# Altium schematic sheet VALVEBOARD_DigitalPower.SchDoc
size A4; SheetNumber: 3; SheetTotal: 9
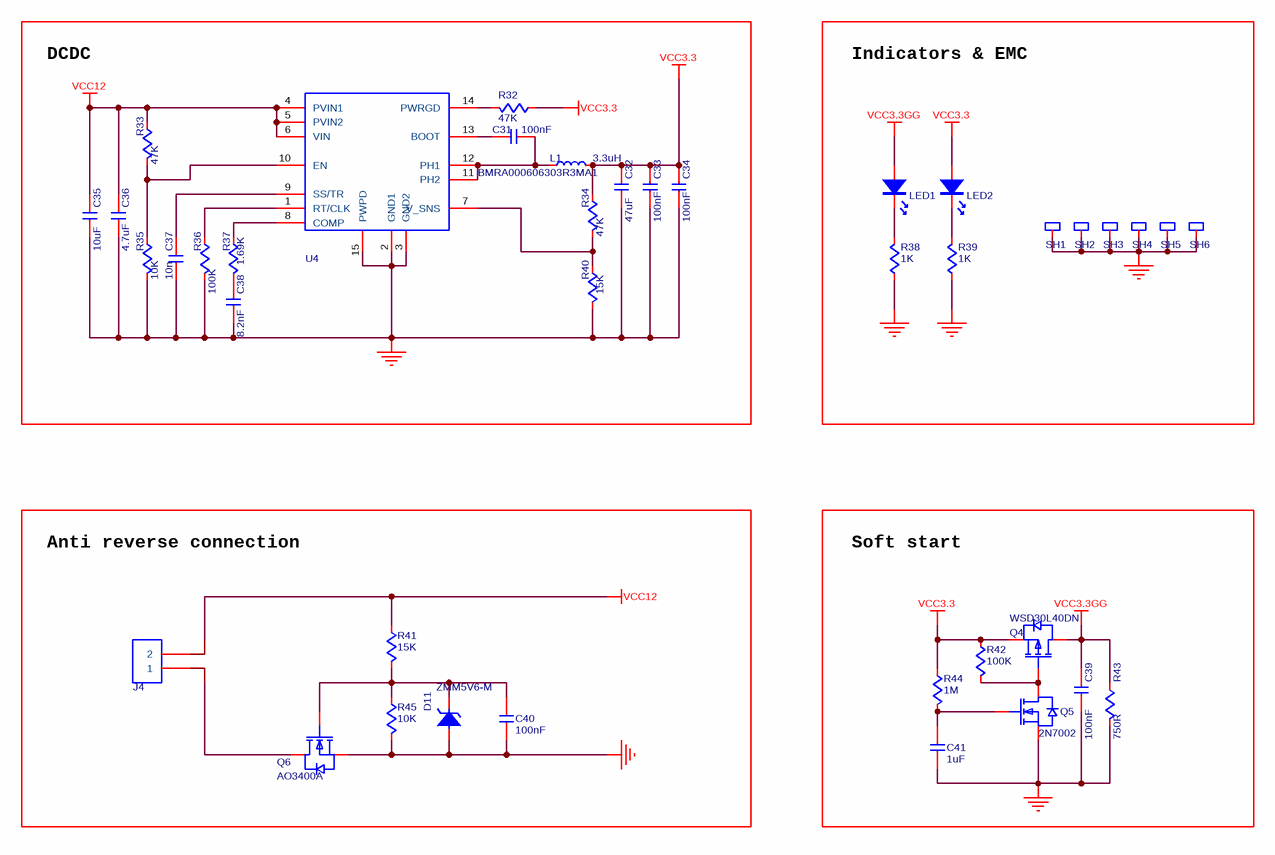
[diagram p0: VALVEBOARD_DigitalPower.SchDoc]

## Parts
C31  value 100nF  [C0402]  (hidden comment: C-NOMO)
C32  value 47uF  [C0805]  (hidden comment: C-NOMO)
C33  value 100nF  [C0402]  (hidden comment: C-NOMO)
C34  value 100nF  [C0402]  (hidden comment: C-NOMO)
C35  value 10uF  [C0805]  (hidden comment: C-NOMO)
C36  value 4.7uF  [C0805]  (hidden comment: C-NOMO)
C37  value 10n  [C0402]  (hidden comment: C-NOMO)
C38  value 8.2nF  [C0402]  (hidden comment: C-NOMO)
C39  value 100nF  [C0402]  (hidden comment: C-NOMO)
C40  value 100nF  [C0402]  (hidden comment: C-NOMO)
C41  value 1uF  [C0603]  (hidden comment: C-NOMO)
D11  ZMM5V6-M  [ZMM5V6-M]
J4  HDR1X2  [KF301-5.0-2P]  (value not drawn)
L1  BMRA000606303R3MA1  value 3.3uH  [FXL0624]
LED1  LED  [LED0603]  (value not drawn)
LED2  LED  [LED0603]  (value not drawn)
Q4  WSD30L40DN  [WSD30L40DN]
Q5  2N7002  [2N7002]
Q6  AO3400A  [AO3400A]
R32  value 47K  [R0402]  (hidden comment: R)
R33  value 47K  [R0402]  (hidden comment: R)
R34  value 47K  [R0402]  (hidden comment: R)
R35  value 10K  [R0402]  (hidden comment: R)
R36  value 100K  [R0402]  (hidden comment: R)
R37  value 1.69K  [R0402]  (hidden comment: R)
R38  value 1K  [R0402]  (hidden comment: R)
R39  value 1K  [R0402]  (hidden comment: R)
R40  value 15K  [R0402]  (hidden comment: R)
R41  value 15K  [R0402]  (hidden comment: R)
R42  value 100K  [R0402]  (hidden comment: R)
R43  value 750R  [R0805]  (hidden comment: R)
R44  value 1M  [R0402]  (hidden comment: R)
R45  value 10K  [R0402]  (hidden comment: R)
SH1  SHIELDSUPPORT  [SHIELDSUPPORT1]  (value not drawn)
SH2  SHIELDSUPPORT  [SHIELDSUPPORT1]  (value not drawn)
SH3  SHIELDSUPPORT  [SHIELDSUPPORT1]  (value not drawn)
SH4  SHIELDSUPPORT  [SHIELDSUPPORT1]  (value not drawn)
SH5  SHIELDSUPPORT  [SHIELDSUPPORT1]  (value not drawn)
SH6  SHIELDSUPPORT  [SHIELDSUPPORT1]  (value not drawn)
U4  TPS54620  [TPS54620]  (value not drawn)

## Blocks framed on the sheet
DCDC: C31-C38 L1 R32-R37 R40 U4
Indicators & EMC: LED1 LED2 R38 R39 SH1-SH6
Anti reverse connection: C40 D11 J4 Q6 R41 R45
Soft start: C39 C41 Q4 Q5 R42-R44

## Nets
DGND: C32.1 C33.1 C34.1 C35.1 C36.1 C37.1 C38.1 C39.1 C40.1 C41.1 D11.2 Q5.S Q6.S R35.1 R36.1 R38.2 R39.2 R40.1 R43.1 R45.1 SH1.SH SH2.SH SH3.SH SH4.SH SH5.SH SH6.SH U4.2(GND1) U4.3(GND2) U4.15(PWPD)
VCC3.3: C32.2 C33.2 C34.2 L1.2 LED2.2 Q4.S R32.2 R34.2 R42.2 R44.2
VCC3.3GG: C39.2 LED1.2 Q4.D R43.2
VCC12: C35.2 C36.2 J4.2 R33.2 R41.2 U4.4(PVIN1) U4.5(PVIN2) U4.6(VIN)
NetC31_1: C31.1 U4.13(BOOT)
NetC31_2: C31.2 L1.1 U4.11(PH2) U4.12(PH1)
NetC37_2: C37.2 U4.9(SS/TR)
NetC38_2: C38.2 R37.1
NetC40_2: C40.2 D11.1 Q6.G R41.1 R45.2
NetC41_2: C41.2 Q5.G R44.1
NetJ4_1: J4.1 Q6.D
NetLED1_1: LED1.1 R38.1
NetLED2_1: LED2.1 R39.1
NetQ4_G: Q4.G Q5.D R42.1
NetR32_1: R32.1 U4.14(PWRGD)
NetR33_1: R33.1 R35.2 U4.10(EN)
NetR34_1: R34.1 R40.2 U4.7(V_SNS)
NetR36_2: R36.2 U4.1(RT/CLK)
NetR37_2: R37.2 U4.8(COMP)

## Library data of the parts
C31-C41 = C-NOMO: voltage: 25V; precision: 5%
L1 = L: Code_IEC: 1005; Published: 8-Jun-2000; LatestRevisionDate: 29-May-2009; LatestRevisionNote: IPC-7351 Footprint Added.; PackageReference: 0402-A; Publisher: Altium Limited; PackageDescription: Chip Inductor; Code_JEITA: 0402
R32-R45 = R: precision: 1%
D11 = ZMM5V6-M: Supplier 1: LCSC; Supplier Part Number 1: C8062
Q4 = WSD30L40DN: Supplier 1: LCSC; Supplier Part Number 1: C148390
Q5 = 2N7002: Supplier 1: LCSC; Supplier Part Number 1: C8545
Q6 = AO3400A: Supplier 1: LCSC; Supplier Part Number 1: C20917